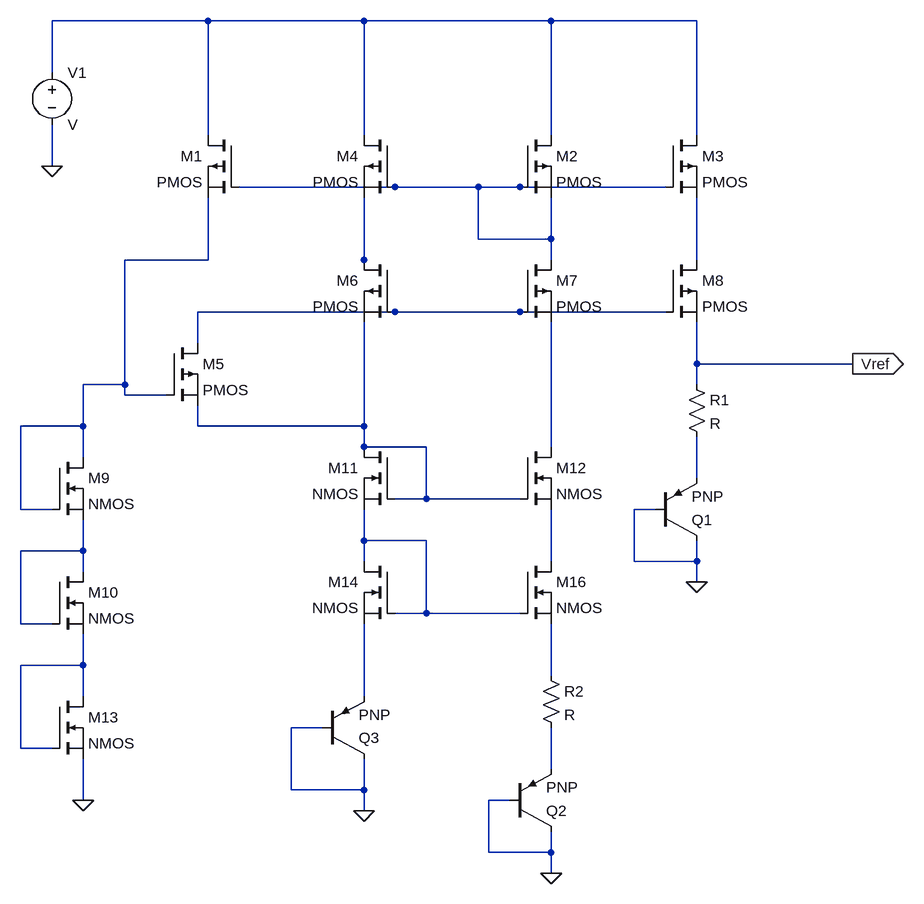
[diagram p0: schematic Draft1.asc]
Draft1.asc, the LTspice schematic file:
Version 4
SHEET 1 988 680
WIRE -112 -1200 -352 -1200
WIRE 128 -1200 -112 -1200
WIRE 416 -1200 128 -1200
WIRE 640 -1200 416 -1200
WIRE -352 -1120 -352 -1200
WIRE -112 -1024 -112 -1200
WIRE 128 -1024 128 -1200
WIRE 416 -1024 416 -1200
WIRE 640 -1024 640 -1200
WIRE -352 -976 -352 -1040
WIRE 176 -944 -64 -944
WIRE 304 -944 176 -944
WIRE 368 -944 304 -944
WIRE 592 -944 368 -944
WIRE 304 -864 304 -944
WIRE 416 -864 416 -928
WIRE 416 -864 304 -864
WIRE -112 -832 -112 -928
WIRE -112 -832 -240 -832
WIRE 128 -832 128 -928
WIRE 416 -832 416 -864
WIRE 640 -832 640 -928
WIRE 128 -816 128 -832
WIRE 176 -752 -128 -752
WIRE 368 -752 176 -752
WIRE 592 -752 368 -752
WIRE -128 -704 -128 -752
WIRE 640 -672 640 -736
WIRE 880 -672 640 -672
WIRE -240 -640 -240 -832
WIRE -240 -640 -304 -640
WIRE 640 -640 640 -672
WIRE -240 -624 -240 -640
WIRE -176 -624 -240 -624
WIRE -304 -576 -304 -640
WIRE -304 -576 -400 -576
WIRE -128 -576 -128 -608
WIRE 128 -576 128 -736
WIRE 128 -576 -128 -576
WIRE 128 -544 128 -576
WIRE 224 -544 128 -544
WIRE 416 -544 416 -736
WIRE -304 -528 -304 -576
WIRE 640 -496 640 -560
WIRE 224 -464 224 -544
WIRE 224 -464 176 -464
WIRE 368 -464 224 -464
WIRE -400 -448 -400 -576
WIRE -352 -448 -400 -448
WIRE 576 -448 544 -448
WIRE 128 -400 128 -448
WIRE 224 -400 128 -400
WIRE -304 -384 -304 -432
WIRE -304 -384 -400 -384
WIRE 128 -368 128 -400
WIRE 416 -368 416 -448
WIRE 544 -368 544 -448
WIRE 640 -368 640 -400
WIRE 640 -368 544 -368
WIRE -304 -352 -304 -384
WIRE 640 -336 640 -368
WIRE 224 -288 224 -400
WIRE 224 -288 176 -288
WIRE 368 -288 224 -288
WIRE -400 -272 -400 -384
WIRE -352 -272 -400 -272
WIRE -304 -208 -304 -256
WIRE -304 -208 -400 -208
WIRE 416 -192 416 -272
WIRE -304 -160 -304 -208
WIRE 128 -160 128 -272
WIRE 64 -112 16 -112
WIRE -400 -80 -400 -208
WIRE -352 -80 -400 -80
WIRE 416 -48 416 -112
WIRE 16 -16 16 -112
WIRE 128 -16 128 -64
WIRE 128 -16 16 -16
WIRE -304 0 -304 -64
WIRE 352 0 320 0
WIRE 128 16 128 -16
WIRE 320 80 320 0
WIRE 416 80 416 48
WIRE 416 80 320 80
WIRE 416 112 416 80
FLAG -304 0 0
FLAG 128 16 0
FLAG 416 112 0
FLAG 640 -336 0
FLAG 880 -672 Vref
IOPIN 880 -672 Out
FLAG -352 -976 0
SYMBOL pmos -64 -1024 M0
SYMATTR InstName M1
SYMBOL pmos 368 -1024 R0
SYMATTR InstName M2
SYMBOL pmos 592 -1024 R0
SYMATTR InstName M3
SYMBOL pmos 176 -1024 M0
SYMATTR InstName M4
SYMBOL pmos -176 -704 R0
SYMATTR InstName M5
SYMBOL pmos 176 -832 M0
SYMATTR InstName M6
SYMBOL pmos 368 -832 R0
SYMATTR InstName M7
SYMBOL pmos 592 -832 R0
SYMATTR InstName M8
SYMBOL nmos -352 -528 R0
SYMATTR InstName M9
SYMBOL nmos -352 -352 R0
SYMATTR InstName M10
SYMBOL nmos 176 -544 M0
SYMATTR InstName M11
SYMBOL nmos 368 -544 R0
SYMATTR InstName M12
SYMBOL nmos -352 -160 R0
SYMATTR InstName M13
SYMBOL nmos 176 -368 M0
SYMATTR InstName M14
SYMBOL nmos 368 -368 R0
SYMATTR InstName M16
SYMBOL res 624 -656 R0
SYMATTR InstName R1
SYMBOL res 400 -208 R0
SYMATTR InstName R2
SYMBOL pnp 576 -400 M180
SYMATTR InstName Q1
SYMBOL pnp 352 48 M180
SYMATTR InstName Q2
SYMBOL pnp 64 -64 M180
SYMATTR InstName Q3
SYMBOL voltage -352 -1136 R0
SYMATTR InstName V1

The netlist it stands for:
* Draft1.asc
M1 N001 N002 N003 N003 PMOS
M2 N001 N002 N002 N002 PMOS
M3 N001 N002 N005 N005 PMOS
M4 N001 N002 N004 N004 PMOS
M5 N006 N003 N007 N007 PMOS
M6 N004 N006 N007 N007 PMOS
M7 N002 N006 N008 N008 PMOS
M8 N005 N006 Vref Vref PMOS
M9 N003 N003 N011 N011 NMOS
M10 N011 N011 N013 N013 NMOS
M11 N007 N007 N010 N010 NMOS
M12 N008 N007 N012 N012 NMOS
M13 N013 N013 0 0 NMOS
M14 N010 N010 N015 N015 NMOS
M16 N012 N010 N014 N014 NMOS
R1 Vref N009 R
R2 N014 N016 R
Q1 0 0 N009 0 PNP
Q2 0 0 N016 0 PNP
Q3 0 0 N015 0 PNP
V1 N001 0 V
.model NPN NPN
.model PNP PNP
.lib standard.bjt
.model NMOS NMOS
.model PMOS PMOS
.lib standard.mos
.backanno
.end